# EAGLE design ingress_res (EAGLE 7.3.0)

## Sheet 1 of 2
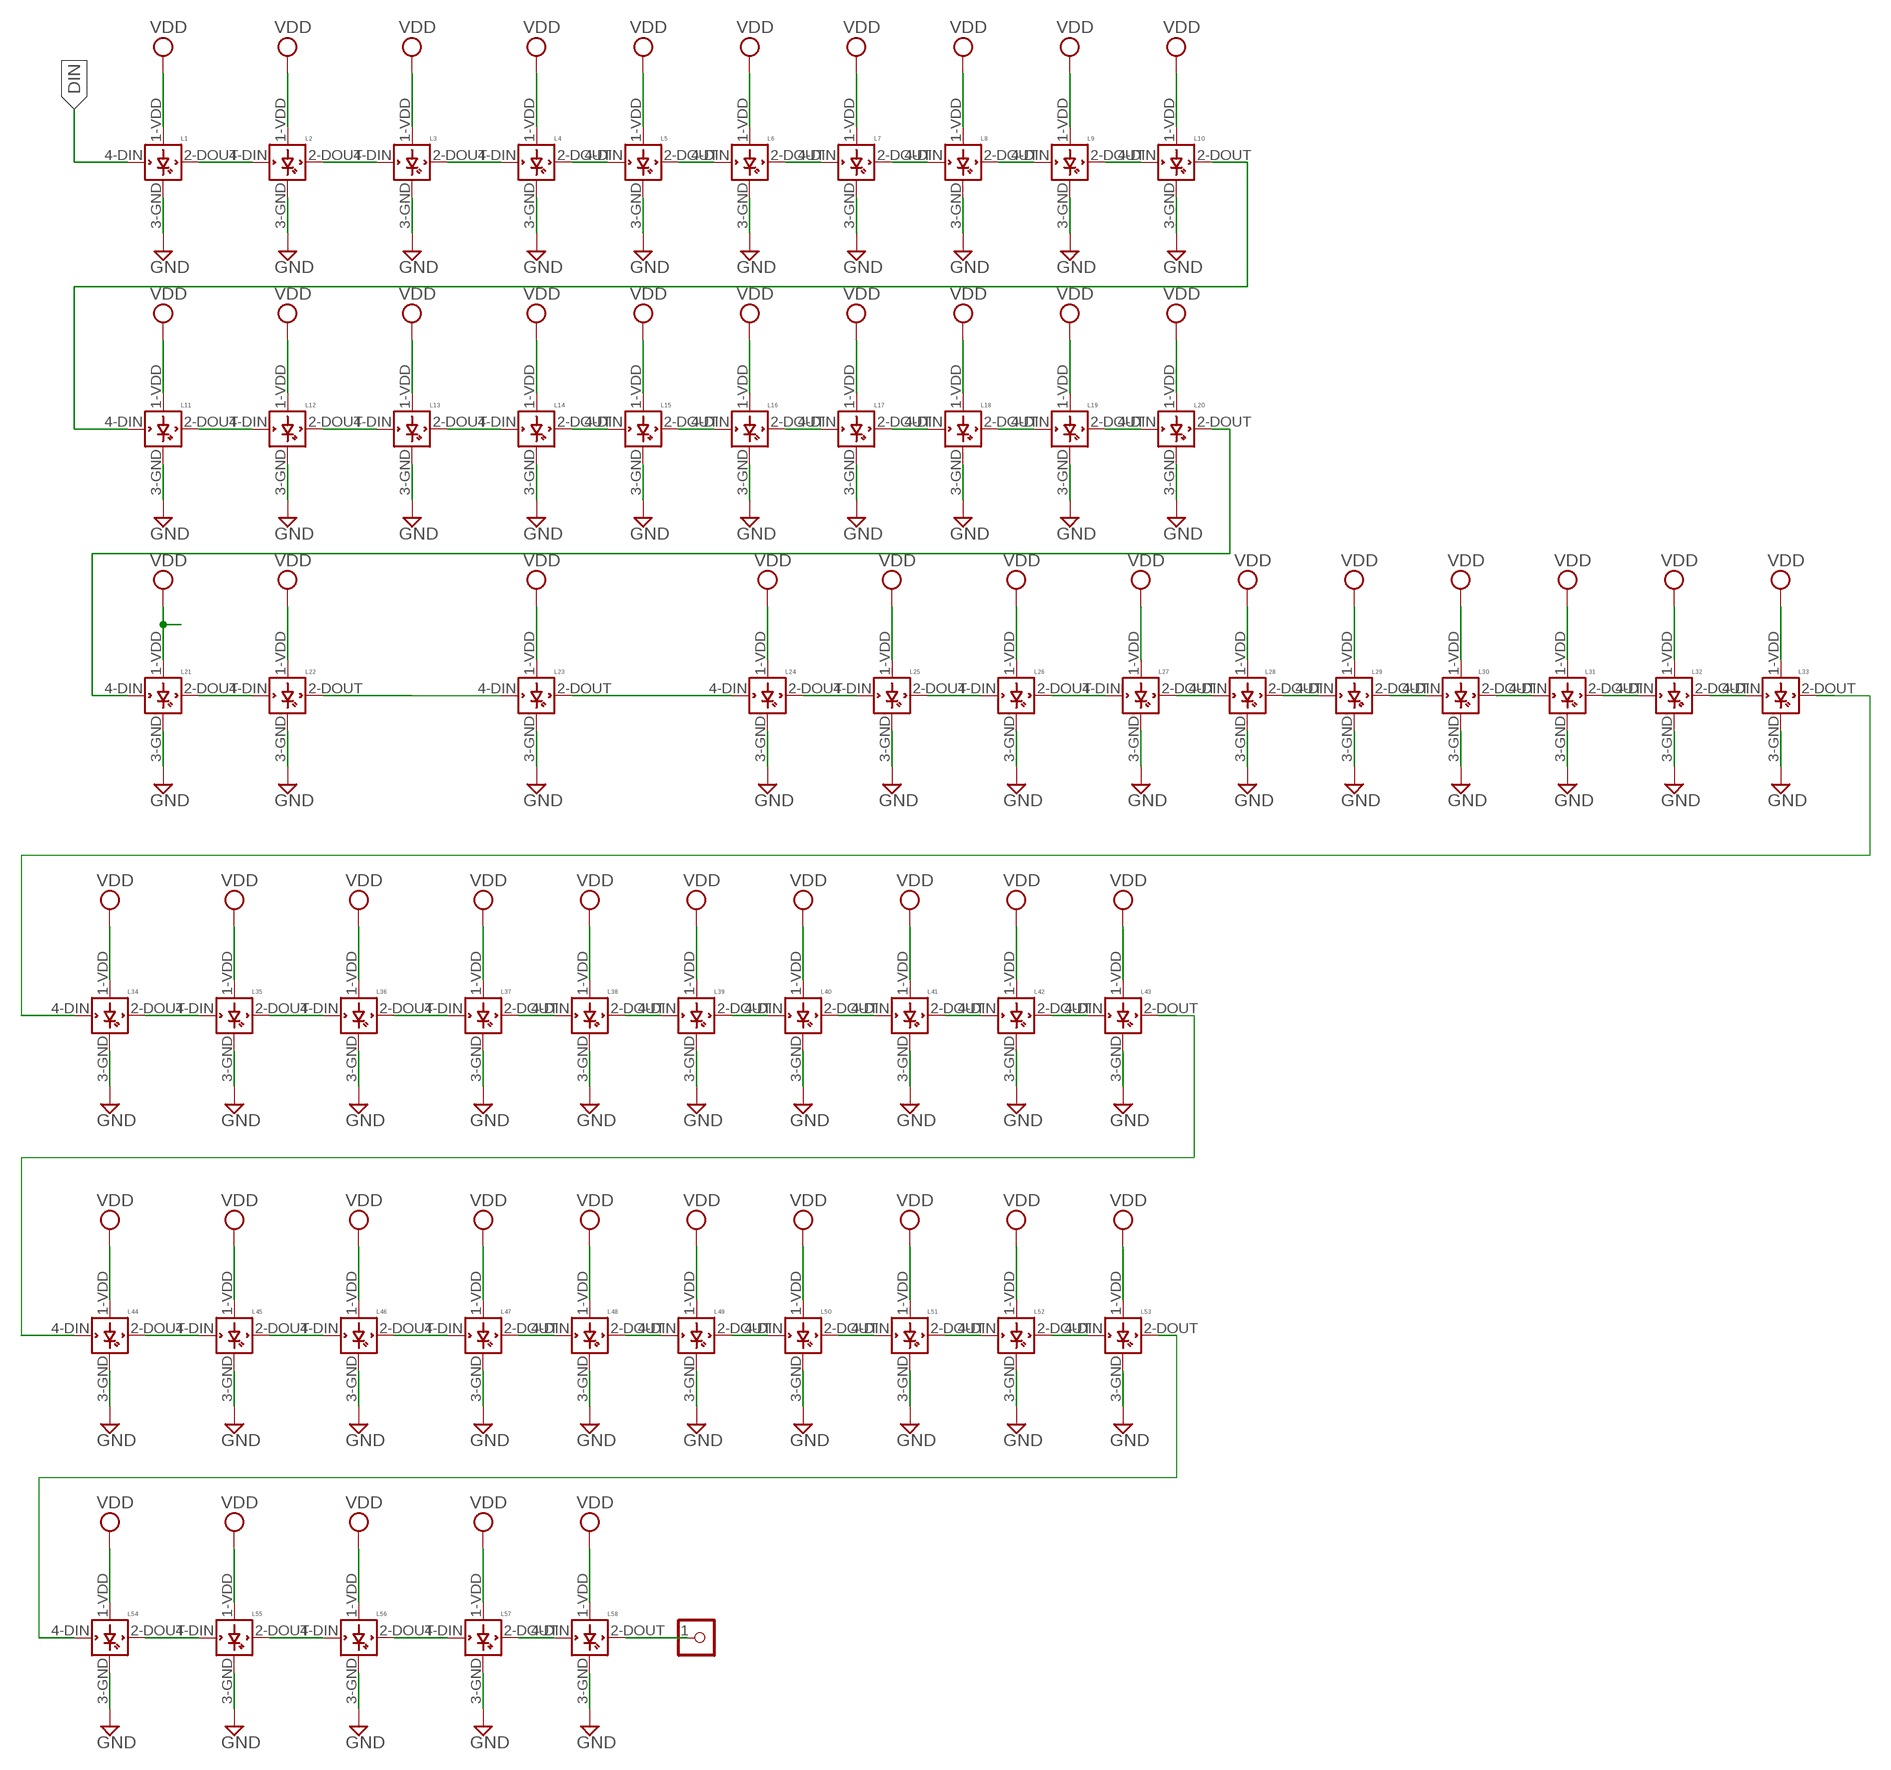
[diagram p0: schematic, sheet 1]

### Parts
J1  CON_HEADER_1X01-PTH_10_17  [M1X2_10_17]
L1  WS2812B  [WS2812B]
L2  WS2812B  [WS2812B]
L3  WS2812B  [WS2812B]
L4  WS2812B  [WS2812B]
L5  WS2812B  [WS2812B]
L6  WS2812B  [WS2812B]
L7  WS2812B  [WS2812B]
L8  WS2812B  [WS2812B]
L9  WS2812B  [WS2812B]
L10  WS2812B  [WS2812B]
L11  WS2812B  [WS2812B]
L12  WS2812B  [WS2812B]
L13  WS2812B  [WS2812B]
L14  WS2812B  [WS2812B]
L15  WS2812B  [WS2812B]
L16  WS2812B  [WS2812B]
L17  WS2812B  [WS2812B]
L18  WS2812B  [WS2812B]
L19  WS2812B  [WS2812B]
L20  WS2812B  [WS2812B]
L21  WS2812B  [WS2812B]
L22  WS2812B  [WS2812B]
L23  WS2812B  [WS2812B]
L24  WS2812B  [WS2812B]
L25  WS2812B  [WS2812B]
L26  WS2812B  [WS2812B]
L27  WS2812B  [WS2812B]
L28  WS2812B  [WS2812B]
L29  WS2812B  [WS2812B]
L30  WS2812B  [WS2812B]
L31  WS2812B  [WS2812B]
L32  WS2812B  [WS2812B]
L33  WS2812B  [WS2812B]
L34  WS2812B  [WS2812B]
L35  WS2812B  [WS2812B]
L36  WS2812B  [WS2812B]
L37  WS2812B  [WS2812B]
L38  WS2812B  [WS2812B]
L39  WS2812B  [WS2812B]
L40  WS2812B  [WS2812B]
L41  WS2812B  [WS2812B]
L42  WS2812B  [WS2812B]
L43  WS2812B  [WS2812B]
L44  WS2812B  [WS2812B]
L45  WS2812B  [WS2812B]
L46  WS2812B  [WS2812B]
L47  WS2812B  [WS2812B]
L48  WS2812B  [WS2812B]
L49  WS2812B  [WS2812B]
L50  WS2812B  [WS2812B]
L51  WS2812B  [WS2812B]
L52  WS2812B  [WS2812B]
L53  WS2812B  [WS2812B]
L54  WS2812B  [WS2812B]
L55  WS2812B  [WS2812B]
L56  WS2812B  [WS2812B]
L57  WS2812B  [WS2812B]
L58  WS2812B  [WS2812B]

### Nets
DIN: L1.4-DIN(DIN) ; also sheet 2
GND: L1.3-GND(GND) L2.3-GND(GND) L3.3-GND(GND) L4.3-GND(GND) L5.3-GND(GND) L6.3-GND(GND) L7.3-GND(GND) L8.3-GND(GND) L9.3-GND(GND) L10.3-GND(GND) L11.3-GND(GND) L12.3-GND(GND) L13.3-GND(GND) L14.3-GND(GND) L15.3-GND(GND) L16.3-GND(GND) L17.3-GND(GND) L18.3-GND(GND) L19.3-GND(GND) L20.3-GND(GND) L21.3-GND(GND) L22.3-GND(GND) L23.3-GND(GND) L24.3-GND(GND) L25.3-GND(GND) L26.3-GND(GND) L27.3-GND(GND) L28.3-GND(GND) L29.3-GND(GND) L30.3-GND(GND) L31.3-GND(GND) L32.3-GND(GND) L33.3-GND(GND) L34.3-GND(GND) L35.3-GND(GND) L36.3-GND(GND) L37.3-GND(GND) L38.3-GND(GND) L39.3-GND(GND) L40.3-GND(GND) L41.3-GND(GND) L42.3-GND(GND) L43.3-GND(GND) L44.3-GND(GND) L45.3-GND(GND) L46.3-GND(GND) L47.3-GND(GND) L48.3-GND(GND) L49.3-GND(GND) L50.3-GND(GND) L51.3-GND(GND) L52.3-GND(GND) L53.3-GND(GND) L54.3-GND(GND) L55.3-GND(GND) L56.3-GND(GND) L57.3-GND(GND) L58.3-GND(GND) ; also sheet 2
N$1: L1.2-DOUT(DOUT) L2.4-DIN(DIN)
N$2: L3.2-DOUT(DOUT) L4.4-DIN(DIN)
N$3: L4.2-DOUT(DOUT) L5.4-DIN(DIN)
N$4: L5.2-DOUT(DOUT) L6.4-DIN(DIN)
N$5: L6.2-DOUT(DOUT) L7.4-DIN(DIN)
N$6: L7.2-DOUT(DOUT) L8.4-DIN(DIN)
N$7: L8.2-DOUT(DOUT) L9.4-DIN(DIN)
N$8: L9.2-DOUT(DOUT) L10.4-DIN(DIN)
N$9: L11.2-DOUT(DOUT) L12.4-DIN(DIN)
N$10: L12.2-DOUT(DOUT) L13.4-DIN(DIN)
N$11: L13.2-DOUT(DOUT) L14.4-DIN(DIN)
N$12: L14.2-DOUT(DOUT) L15.4-DIN(DIN)
N$13: L15.2-DOUT(DOUT) L16.4-DIN(DIN)
N$14: L16.2-DOUT(DOUT) L17.4-DIN(DIN)
N$15: L17.2-DOUT(DOUT) L18.4-DIN(DIN)
N$16: L18.2-DOUT(DOUT) L19.4-DIN(DIN)
N$17: L19.2-DOUT(DOUT) L20.4-DIN(DIN)
N$18: L21.2-DOUT(DOUT) L22.4-DIN(DIN)
N$19: L22.2-DOUT(DOUT) L23.4-DIN(DIN)
N$25: L10.2-DOUT(DOUT) L11.4-DIN(DIN)
N$26: L20.2-DOUT(DOUT) L21.4-DIN(DIN)
N$27: L2.2-DOUT(DOUT) L3.4-DIN(DIN)
N$38: L23.2-DOUT(DOUT) L24.4-DIN(DIN)
N$39: L24.2-DOUT(DOUT) L25.4-DIN(DIN)
N$40: L25.2-DOUT(DOUT) L26.4-DIN(DIN)
N$41: L26.2-DOUT(DOUT) L27.4-DIN(DIN)
N$42: L27.2-DOUT(DOUT) L28.4-DIN(DIN)
N$43: L28.2-DOUT(DOUT) L29.4-DIN(DIN)
N$44: L29.2-DOUT(DOUT) L30.4-DIN(DIN)
N$45: L30.2-DOUT(DOUT) L31.4-DIN(DIN)
N$46: L31.2-DOUT(DOUT) L32.4-DIN(DIN)
N$47: L32.2-DOUT(DOUT) L33.4-DIN(DIN)
N$49: L33.2-DOUT(DOUT) L34.4-DIN(DIN)
N$50: L34.2-DOUT(DOUT) L35.4-DIN(DIN)
N$51: L35.2-DOUT(DOUT) L36.4-DIN(DIN)
N$52: L36.2-DOUT(DOUT) L37.4-DIN(DIN)
N$53: L37.2-DOUT(DOUT) L38.4-DIN(DIN)
N$54: L38.2-DOUT(DOUT) L39.4-DIN(DIN)
N$55: L39.2-DOUT(DOUT) L40.4-DIN(DIN)
N$56: L40.2-DOUT(DOUT) L41.4-DIN(DIN)
N$57: L41.2-DOUT(DOUT) L42.4-DIN(DIN)
N$58: L42.2-DOUT(DOUT) L43.4-DIN(DIN)
N$60: L43.2-DOUT(DOUT) L44.4-DIN(DIN)
N$61: L44.2-DOUT(DOUT) L45.4-DIN(DIN)
N$62: L45.2-DOUT(DOUT) L46.4-DIN(DIN)
N$63: L46.2-DOUT(DOUT) L47.4-DIN(DIN)
N$64: L47.2-DOUT(DOUT) L48.4-DIN(DIN)
N$65: L48.2-DOUT(DOUT) L49.4-DIN(DIN)
N$66: L49.2-DOUT(DOUT) L50.4-DIN(DIN)
N$67: L50.2-DOUT(DOUT) L51.4-DIN(DIN)
N$68: L51.2-DOUT(DOUT) L52.4-DIN(DIN)
N$69: L52.2-DOUT(DOUT) L53.4-DIN(DIN)
N$70: L53.2-DOUT(DOUT) L54.4-DIN(DIN)
N$72: L54.2-DOUT(DOUT) L55.4-DIN(DIN)
N$73: L55.2-DOUT(DOUT) L56.4-DIN(DIN)
N$74: L56.2-DOUT(DOUT) L57.4-DIN(DIN)
N$75: L57.2-DOUT(DOUT) L58.4-DIN(DIN)
N$76: J1.1 L58.2-DOUT(DOUT)
VCC: L1.1-VDD(VDD) L2.1-VDD(VDD) L3.1-VDD(VDD) L4.1-VDD(VDD) L5.1-VDD(VDD) L6.1-VDD(VDD) L7.1-VDD(VDD) L8.1-VDD(VDD) L9.1-VDD(VDD) L10.1-VDD(VDD) L11.1-VDD(VDD) L12.1-VDD(VDD) L13.1-VDD(VDD) L14.1-VDD(VDD) L15.1-VDD(VDD) L16.1-VDD(VDD) L17.1-VDD(VDD) L18.1-VDD(VDD) L19.1-VDD(VDD) L20.1-VDD(VDD) L21.1-VDD(VDD) L22.1-VDD(VDD) L23.1-VDD(VDD) L24.1-VDD(VDD) L25.1-VDD(VDD) L26.1-VDD(VDD) L27.1-VDD(VDD) L28.1-VDD(VDD) L29.1-VDD(VDD) L30.1-VDD(VDD) L31.1-VDD(VDD) L32.1-VDD(VDD) L33.1-VDD(VDD) L34.1-VDD(VDD) L35.1-VDD(VDD) L36.1-VDD(VDD) L37.1-VDD(VDD) L38.1-VDD(VDD) L39.1-VDD(VDD) L40.1-VDD(VDD) L41.1-VDD(VDD) L42.1-VDD(VDD) L43.1-VDD(VDD) L44.1-VDD(VDD) L45.1-VDD(VDD) L46.1-VDD(VDD) L47.1-VDD(VDD) L48.1-VDD(VDD) L49.1-VDD(VDD) L50.1-VDD(VDD) L51.1-VDD(VDD) L52.1-VDD(VDD) L53.1-VDD(VDD) L54.1-VDD(VDD) L55.1-VDD(VDD) L56.1-VDD(VDD) L57.1-VDD(VDD) L58.1-VDD(VDD) ; supply symbol labelled VDD ; also sheet 2

## Sheet 2 of 2
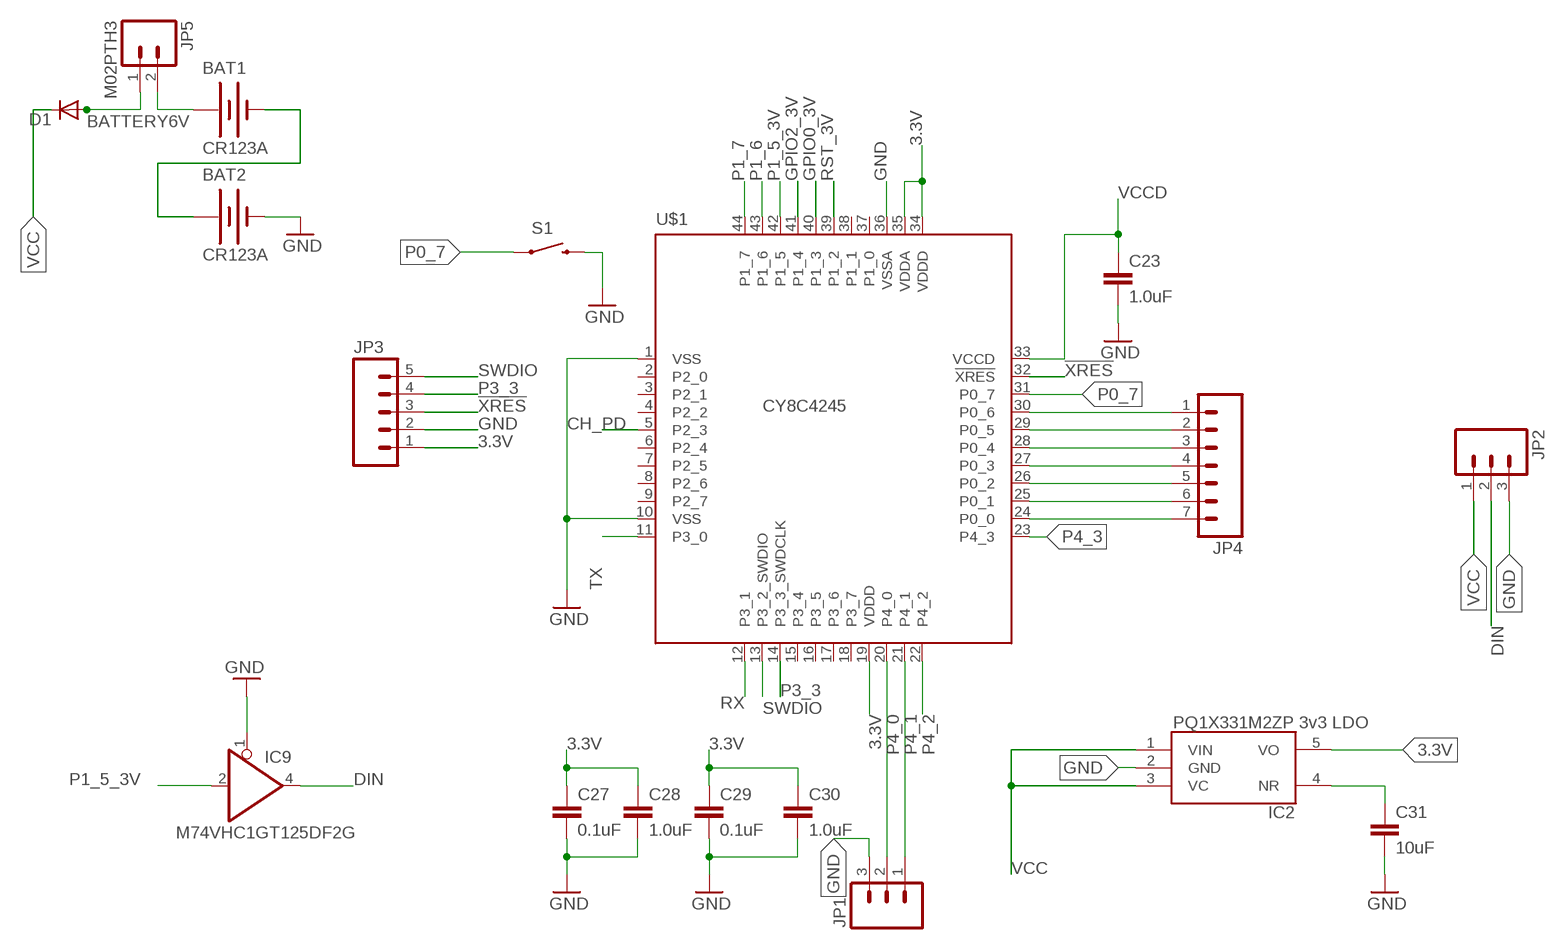
[diagram p1: schematic, sheet 2]

### Parts
BAT1  CR123A  BATTERYCR123A  [BATTERY_CR123A]
BAT2  CR123A  BATTERYCR123A  [BATTERY_CR123A]
C23  1.0uF  CAP0805  [0805]
C27  0.1uF  CAP0805  [0805]
C28  1.0uF  CAP0805  [0805]
C29  0.1uF  CAP0805  [0805]
C30  1.0uF  CAP0805  [0805]
C31  10uF  CAP0805  [0805]
D1  DIODESMA  [SMA-DIODE]
IC2  PQ1X331M2ZP-3V3-LDO-SOT-23-5  [SOT-23-5]
IC9  M74VHC1GT125DF2G  74AHC1G125DCK  [SC70-5]
JP1  M031X03_NO_SILK  [1X03_NO_SILK]
JP2  M031X03_NO_SILK  [1X03_NO_SILK]
JP3  M05PTH  [1X05]
JP4  M07  [1X07]
JP5  M02PTH3  [1X02_LONGPADS]
S1  SPARKFUN_SWITCH-MOMENTARY-2SMD  [SPARKFUN_TACTILE_SWITCH_SMD]
U$1  CY8C4245  CY8C4245AXI-483  [TQFP44]

### Nets
3.3V: C27.1 C28.1 C29.1 C30.1 IC2.5(VO) JP3.1 U$1.19(VDDD) U$1.34(VDDD) U$1.35(VDDA)
!XRES: JP3.3 U$1.32(!XRES)
BATTERY6V: D1.A JP5.1
CH_PD: U$1.5(P2_3)
DIN: IC9.4(O) JP2.2 ; also sheet 1
GND: BAT2.- C23.2 C27.2 C28.2 C29.2 C30.2 C31.2 IC2.2(GND) IC9.1(OE) JP1.3 JP2.3 JP3.2 S1.3 U$1.1(VSS) U$1.10(VSS) U$1.36(VSSA) ; also sheet 1
GPIO0_3V: U$1.40(P1_3)
GPIO2_3V: U$1.41(P1_4)
N$24: C31.1 IC2.4(NR)
N$28: BAT1.- BAT2.+
N$29: JP4.7 U$1.24(P0_0)
N$30: JP4.6 U$1.25(P0_1)
N$31: JP4.5 U$1.26(P0_2)
N$32: JP4.4 U$1.27(P0_3)
N$33: JP4.3 U$1.28(P0_4)
N$34: JP4.2 U$1.29(P0_5)
N$35: JP4.1 U$1.30(P0_6)
N$36: BAT1.+ JP5.2
P0_7: S1.1 U$1.31(P0_7)
P1_5_3V: IC9.2(I) U$1.42(P1_5)
P1_6: U$1.43(P1_6)
P1_7: U$1.44(P1_7)
P3_3: JP3.4 U$1.14(P3_3_SWDCLK)
P4_0: JP1.2 U$1.20(P4_0)
P4_1: JP1.1 U$1.21(P4_1)
P4_2: U$1.22(P4_2)
P4_3: U$1.23(P4_3)
RST_3V: U$1.39(P1_2)
RX: U$1.12(P3_1)
SWDIO: JP3.5 U$1.13(P3_2_SWDIO)
TX: U$1.11(P3_0)
VCC: D1.C IC2.1(VIN) IC2.3(VC) JP2.1 ; also sheet 1
VCCD: C23.1 U$1.33(VCCD)
Unconnected: U$1.2(P2_0) U$1.3(P2_1) U$1.4(P2_2) U$1.6(P2_4) U$1.7(P2_5) U$1.8(P2_6) U$1.9(P2_7) U$1.15(P3_4) U$1.16(P3_5) U$1.17(P3_6) U$1.18(P3_7) U$1.37(P1_0) U$1.38(P1_1)

## Power pins joined to a net without a drawn wire
GND: IC9.3(GND)
VCC: IC9.5(VCC)

## Library data of the parts
BAT1 BAT2 = ingress_res:BATTERY: Battery Holders Various common sizes : AA, AAA, 20mm coin cell and 12mm coin cell.
C23 C27-C31 = SparkFun-Capacitors:CAP: Capacitor Standard 0603 ceramic capacitor, and 0.1" leaded capacitor.
D1 = SparkFun-DiscreteSemi:DIODE: Diode These are standard reverse protection diodes and small signal diodes. SMA package can handle up to about 1A. SOD-323 can handle about 200mA. What the SOD-323 package when ordering, there are some mfgs out there that are 5-pin packages.
IC2 = STM32-PROX:PQ1X331M2ZP-3V3-LDO-SOT-23-5
IC9 = 74xx-little-de:74*1G125: Single Bus Buffer Gate with 3-State Output; DIGIKEY-ND: M74VHC1GT125DF1GOSCT-ND; MOUSER: 863-M74VHC1GT125DF2G; PARTNO: M74VHC1GT125DF2G
J1 = dp_devices:CON_HEADER_1X01
JP1 JP2 = SparkFun-Connectors:M03: Header 3 Standard 3-pin 0.1" header. Use with straight break away headers (SKU : PRT-00116), right angle break away headers (PRT-00553), swiss pins (PRT-00743), machine pins (PRT-00117), and female headers (PRT-00115). Molex polarized connector foot print use with SKU : PRT-08232 with associated crimp pins and housings.
JP3 = SparkFun-Connectors:M05: Header 5 Standard 5-pin 0.1" header. Use with straight break away headers (SKU : PRT-00116), right angle break away headers (PRT-00553), swiss pins (PRT-00743), machine pins (PRT-00117), and female headers (PRT-00115). Molex polarized connector foot print use with SKU : PRT-08230 with associated crimp pins and housings.
JP4 = SparkFun:M07: Header 7 Standard 7-pin 0.1" header. Use with straight break away headers (SKU : PRT-00116), right angle break away headers (PRT-00553), swiss pins (PRT-00743), machine pins (PRT-00117), and female headers (PRT-00115). NOTES ON THE VARIANTS LOCK and LOCK_LONGPADS... This footprint was designed to help hold the alignment of a through-hole component (i.e. 7-pin header) while soldering it into place. You may notice that each hole has been shifted either up or down by 0.005 of an inch from it's more standard position (which is usually a perfectly straight line). This slight alteration caused the pins (the squares in the middle) to touch the edges of the holes. Because they are alternating, it causes a "brace" to hold the header in place. 0.005 has proven to be the perfect amount of "off-center" position when using our standard breakaway headers. Although looks a little odd when you look at the bare footprint, once you have a header in there, the alteration is very hard to notice. Also, if you push a header all the way into place, it is covered up entirely on the bottom side. This idea of altering the position of holes to aid alignment will be further integrated into the Sparkfun Library for other footprints. It can help hold any component with 3 or more connection pins.
JP5 = SparkFun-Connectors:M02: Standard 2-pin 0.1" header. Use with - straight break away headers ( PRT-00116) - right angle break away headers (PRT-00553) - swiss pins (PRT-00743) - machine pins (PRT-00117) - female headers (PRT-00115) Molex polarized connector foot print use with: PRT-08233 with associated crimp pins and housings. 2.54_SCREWTERM for use with PRT-10571. 3.5mm Screw Terminal footprints for PRT-08084 5mm Screw Terminal footprints for use with PRT-08433
L1-L58 = adafruit:WS2812B
S1 = Nullspace:SPARKFUN_SWITCH-MOMENTARY-2
U$1 = cypress:CY8C4245AXI-483

## Net classes
0 default: width 0.203 mm

## Board
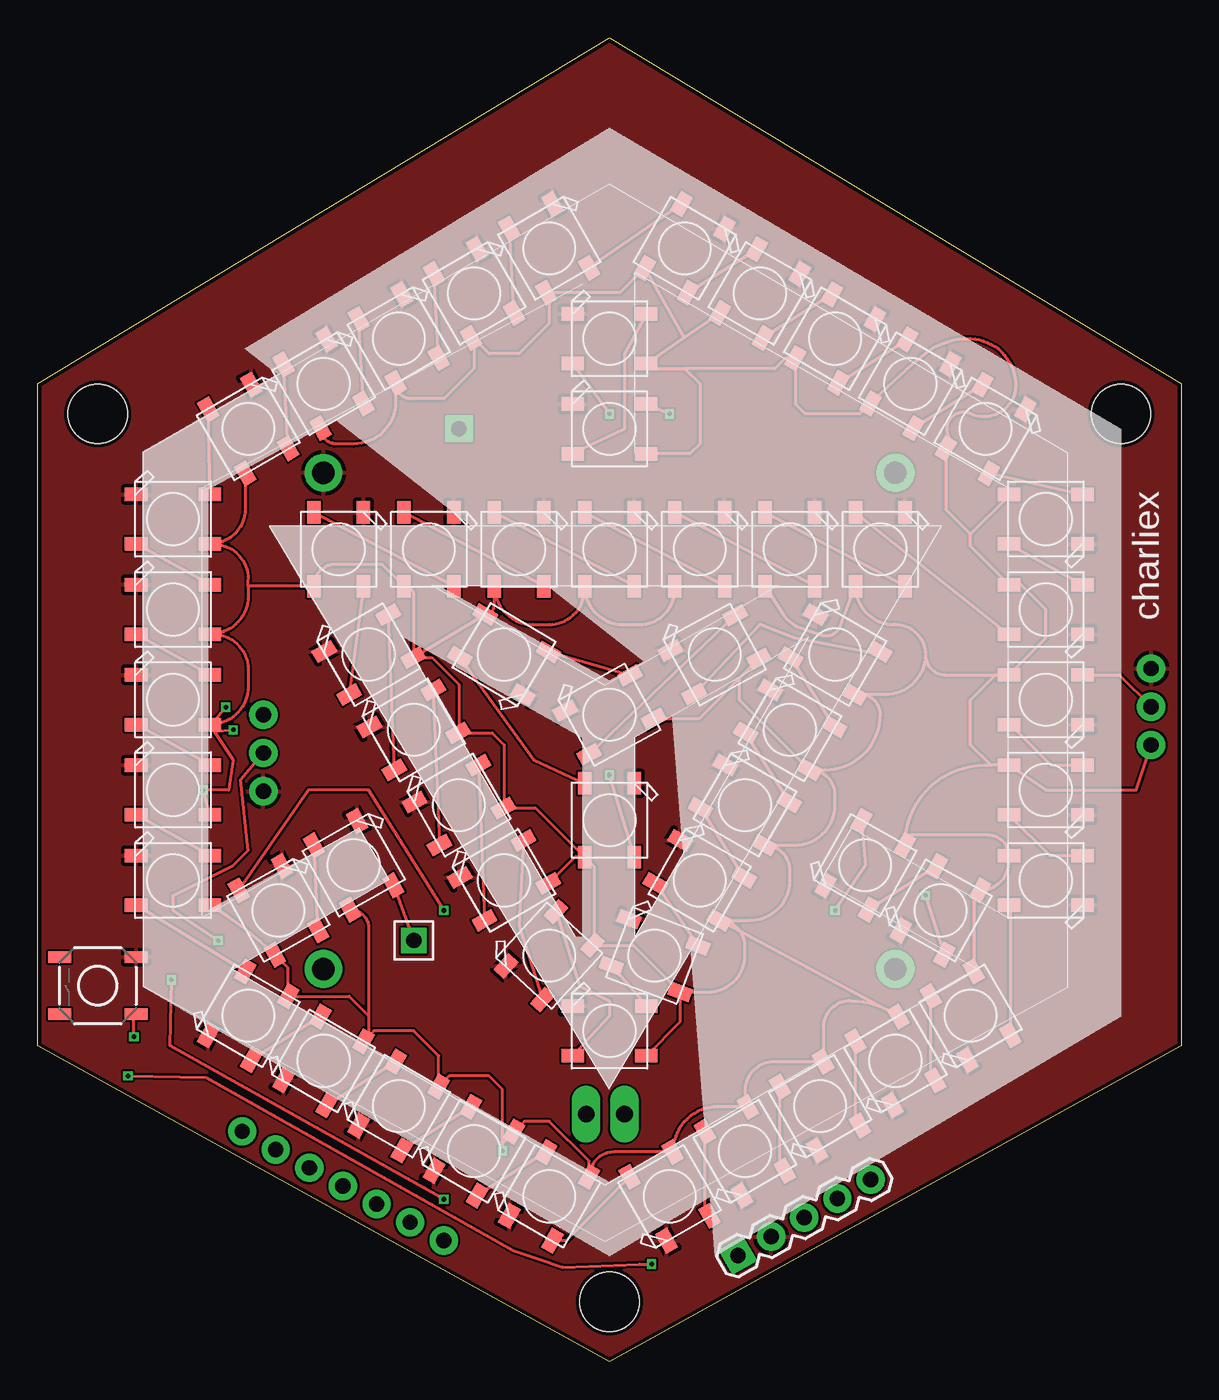
[diagram p2: board, top side]
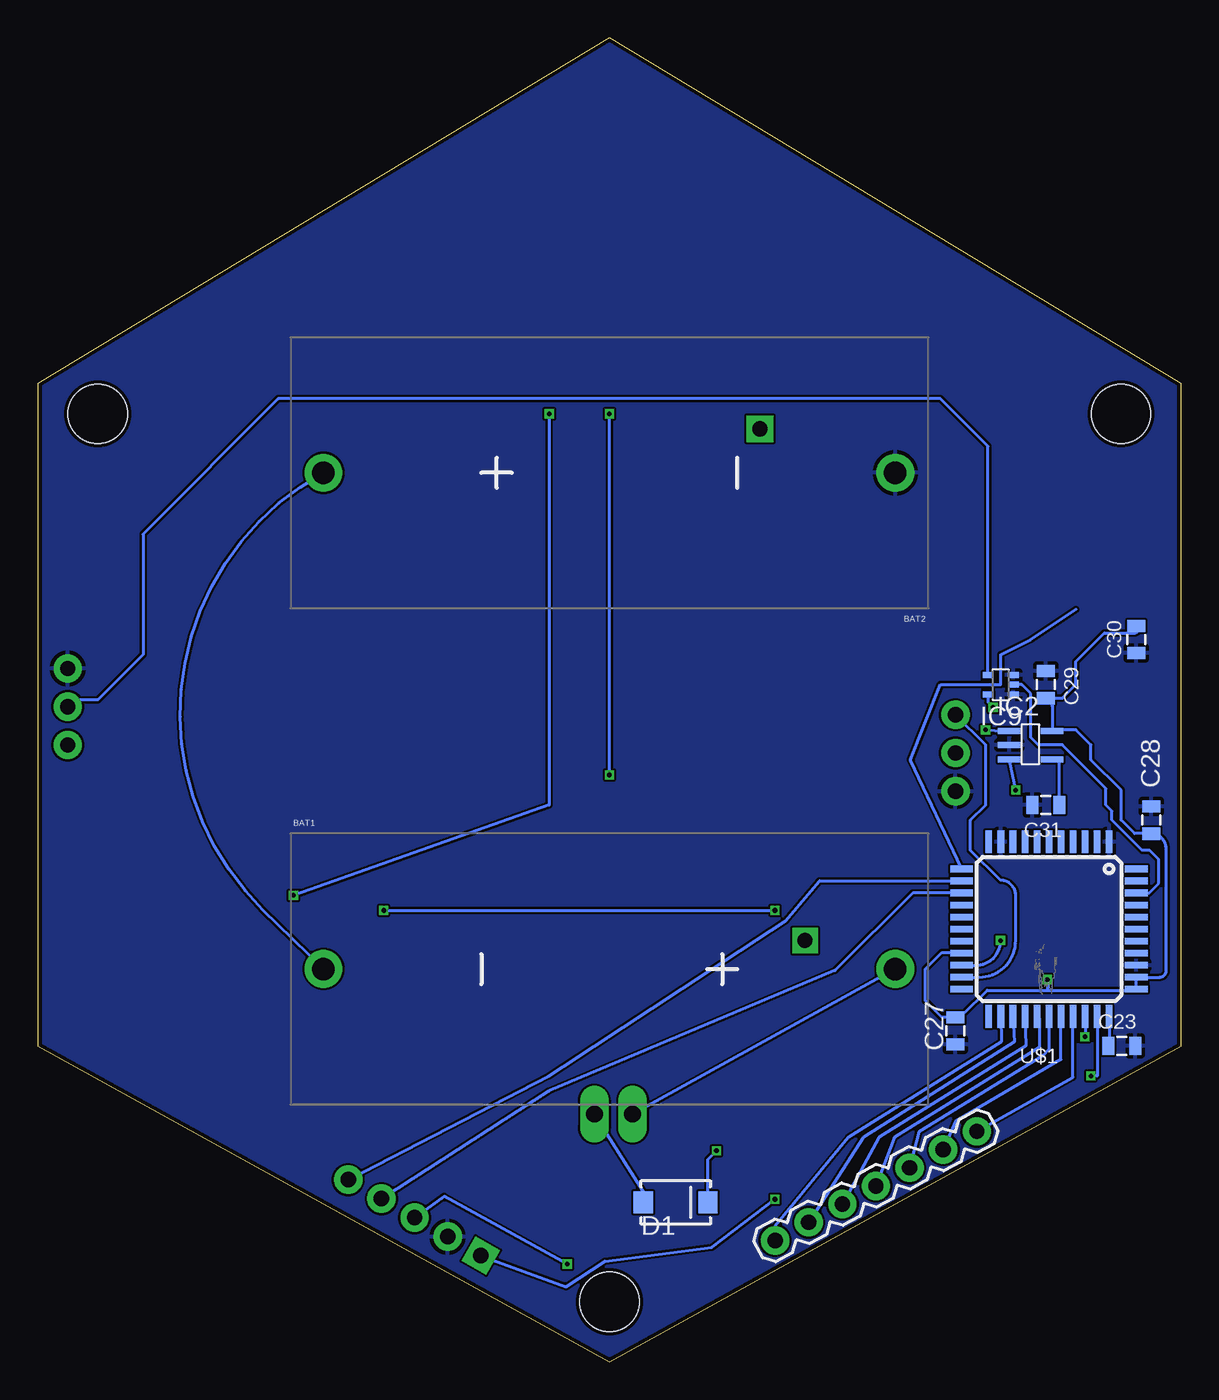
[diagram p3: board, bottom side, seen from below]

Size 76 x 88 mm. Coordinates in mm from the lower left corner, seen from the top.
Outline: 38,0 0,21 0,65 38,88 76,65 76,21 38,0
Copper layers (1*16): Top 0.035mm / dielectric 1.5mm / Bottom 0.035mm
Design rules "ITEADstudio_DRC": minimum track width 6mil, minimum drill 12mil, track to track 6mil, track to pad 6mil, pad to pad 6mil, via to via 6mil, smd to smd 0mil, copper to edge 10mil, drill to drill 10mil, minimum pad ring 10mil, minimum via ring 6mil, stop-mask expansion 2mil, vias tented up to drill 100mil, thermal gap 10mil
Holes 3.94 mm at 72,63 4,63 38,4

### Footprints (pad centres in the part's own frame; a part is rotated, then mirrored left to right if it is on the bottom)
BATTERY_CR123A = drill 1.5 pad 2.5: + 19,0; - -19,0
0805 = smd 0.8 x 1.2: 1 -0.9,0; 2 0.9,0
SMA-DIODE = smd 1.27 x 1.47: A -2.15,0; C 2.15,0
SOT-23-5 = smd 0.4 x 1.5: 1 -0.94,-1.422; 2 0.01,-1.422; 3 0.96,-1.422; 4 0.96,1.428; 5 -0.94,1.428
SC70-5 = smd 0.4 x 0.7: 1 -0.65,-0.85; 2 0,-0.85; 3 0.65,-0.85; 4 0.65,0.85; 5 -0.65,0.85
M1X2_10_17 = drill 1 pad 1.7 square: 1 0,0
1X03_NO_SILK = drill 1.016 pad 1.88: 1 0,0; 2 2.54,0; 3 5.08,0
1X05 = drill 1.016 pad 1.88 square: 1 0,0 | drill 1.016 pad 1.88: 2 2.54,0; 3 5.08,0; 4 7.62,0; 5 10.16,0
1X07 = drill 1.016 pad 1.88: 1 0,0; 2 2.54,0; 3 5.08,0; 4 7.62,0; 5 10.16,0; 6 12.7,0; 7 15.24,0
1X02_LONGPADS = drill 1.118 pad 1.88 long: 1 0,0; 2 2.54,0
WS2812B = smd 1.5 x 0.9: 1-VDD 2.45,-1.65; 2-DOUT 2.45,1.65; 3-GND -2.45,1.65; 4-DIN -2.45,-1.65
SPARKFUN_TACTILE_SWITCH_SMD = smd 1.524 x 0.762: 1 -2.54,1.905; 2 2.54,1.905; 3 -2.54,-1.905; 4 2.54,-1.905
TQFP44 = smd 1.5 x 0.44: 1 -5.8,4; 2 -5.8,3.2; 3 -5.8,2.4; 4 -5.8,1.6; 5 -5.8,0.8; 6 -5.8,0; 7 -5.8,-0.8; 8 -5.8,-1.6; 9 -5.8,-2.4; 10 -5.8,-3.2; 11 -5.8,-4; 23 5.8,-4; 24 5.8,-3.2; 25 5.8,-2.4; 26 5.8,-1.6; 27 5.8,-0.8; 28 5.8,0; 29 5.8,0.8; 30 5.8,1.6; 31 5.8,2.4; 32 5.8,3.2; 33 5.8,4 | smd 0.44 x 1.5: 12 -4,-5.8; 13 -3.2,-5.8; 14 -2.4,-5.8; 15 -1.6,-5.8; 16 -0.8,-5.8; 17 0,-5.8; 18 0.8,-5.8; 19 1.6,-5.8; 20 2.4,-5.8; 21 3.2,-5.8; 22 4,-5.8; 34 4,5.8; 35 3.2,5.8; 36 2.4,5.8; 37 1.6,5.8; 38 0.8,5.8; 39 0,5.8; 40 -0.8,5.8; 41 -1.6,5.8; 42 -2.4,5.8; 43 -3.2,5.8; 44 -4,5.8

### Placement (x,y rotation side)
BAT1  38,26.11 0 bottom
BAT2  38,59.08 180 bottom
C23  3.96,21.01 0 bottom
C27  15,22 270 bottom
C28  2,36 90 bottom
C29  9,45 90 bottom
C30  3,48 270 bottom
C31  9,37 180 bottom
D1  33.6,10.6 0 bottom
IC2  10,41 270 bottom
IC9  12,45 90 bottom
J1  25,28 0 top
JP1  15,43 270 top
JP2  74,41 90 bottom
JP3  46.54,7.06 29.8 top
JP4  13.59,15.32 208.4 bottom
JP5  39,16.46 180 top
L1  67,44 180 top
L2  67,38 180 top
L3  67,32 180 top
L4  62,23 120 top
L5  57,20 120 top
L6  52,17 120 top
L7  47,14 120 top
L8  42,11 120 top
L9  34,11 60 top
L10  29,14 60 top
L11  24,17 60 top
L12  19,20 60 top
L13  14,23 60 top
L14  9,32 0 top
L15  9,38 0 top
L16  9,44 0 top
L17  9,50 0 top
L18  9,56 0 top
L19  14,62 300 top
L20  19,65 300 top
L21  24,68 300 top
L22  29,71 300 top
L23  34,74 300 top
L24  43,74 240 top
L25  48,71 240 top
L26  53,68 240 top
L27  58,65 240 top
L28  63,62 240 top
L29  67,56 180 top
L30  67,50 180 top
L31  56,54 270 top
L32  50,54 270 top
L33  44,54 270 top
L34  38,54 270 top
L35  32,54 270 top
L36  26,54 270 top
L37  20,54 270 top
L38  22,47 30 top
L39  25,42 30 top
L40  28,37 30 top
L41  31,32 30 top
L42  34,27 47.4 top
L43  38,22 0 top
L44  41,27 339.1 top
L45  44,32 330 top
L46  47,37 330 top
L47  50,42 330 top
L48  53,47 330 top
L49  45,47 28.6 top
L50  38,43 28.6 top
L51  31,47 149.2 top
L52  38,36 270 top
L53  38,68 0 top
L54  38,62 0 top
L55  60,30 60.9 top
L56  55,33 60.9 top
L57  16,30 299.4 top
L58  21,33 299.4 top
S1  4,25 180 top
U$1  8.79,28.76 270 bottom

### Tracks (layer width: path | path; a pad name or v marks a point on that pad's centre or on a via)
3.3V  (via drill 0.3)
  Top 0.203: v27,10.8 8.8,21 v8.9,25.4
  Bottom 0.203: C27.1 14.52,22.9 | 14.52,22.9 15.9,22.9 17,24 17,26.1 15.9,27.2 14.63,27.2 U$1.19 | 14.52,22.9 14.52,23.08 12.9,24.7 8.9,24.7 | 8.9,24.7 3.05,24.7 U$1.34 U$1.35 1.44,25.56 arc-90 1,26 1,34.1 arc-90 C28.1 3.1,35.1 4,36 4,38 6,40 6,41 7,42 8.51,42 IC2.5 8.57,43.57 arc-90 9,44 C29.1 7.9,44.1 7,45 7,46.55 5.11,48.45 3.09,48.45 arc-156 C30.1 | JP3.1 40.9,5 38.3,6.7 31.2,7.6 v27,10.8 | v8.9,25.4 8.9,24.7
!XRES  (via drill 0.3)
  Top 0.203: v6,19 11.2,18.9 31.6,7.4 34.9,6.3 40,6.5 v40.8,6.5
  Bottom 0.203: U$1.32 5.59,19 v6,19 | v40.8,6.5 49,11 JP3.3
BATTERY6V
  Bottom 0.203: D1.A 35.75,11.29 JP5.1
DIN
  Top 0.203: L1.4-DIN 71.89,45.65 JP2.2
  Bottom 0.203: IC9.4 12.85,60.85 16,64 60,64 69,55 69,47 72,44 73.54,44 JP2.2
GND
  pour Top: 76,65 38,88 0,65 0,21 38,0 76,21
  pour Bottom: 76,65 38,88 0,65 0,21 38,0 76,21
N$1
  Top 0.203: L1.2-DOUT 64.65,42.35 67,40 67.35,39.65 L2.4-DIN
N$2
  Top 0.203: L3.2-DOUT 64.65,30.25 L4.4-DIN
N$3
  Top 0.203: L5.4-DIN 59.35,19.01 L4.2-DOUT
N$4
  Top 0.203: L6.4-DIN 54.35,16.01 L5.2-DOUT
N$5
  Top 0.203: L7.4-DIN 49.35,13.01 L6.2-DOUT
N$6
  Top 0.203: L8.4-DIN 44.35,10.01 L7.2-DOUT
N$7
  Top 0.203: L8.2-DOUT 35.1,8.05 L9.4-DIN
N$8
  Top 0.203: L9.2-DOUT L10.4-DIN
N$9
  Top 0.203: L11.2-DOUT L12.4-DIN
N$10
  Top 0.203: L12.2-DOUT L13.4-DIN
N$11
  Top 0.203: L13.2-DOUT L14.4-DIN
N$12
  Top 0.203: L14.2-DOUT L15.4-DIN
N$13
  Top 0.203: L15.2-DOUT L16.4-DIN
N$14
  Top 0.203: L16.2-DOUT L17.4-DIN
N$15
  Top 0.203: L17.2-DOUT L18.4-DIN
N$16
  Top 0.203: L18.2-DOUT L19.4-DIN
N$17
  Top 0.203: L19.2-DOUT L20.4-DIN
N$18
  Top 0.203: L21.2-DOUT L22.4-DIN
N$19
  Top 0.203: L22.2-DOUT L23.4-DIN
N$24
  Bottom 0.203: C31.1 8.1,40.04 IC2.4
N$25
  Top 0.203: L10.2-DOUT L11.4-DIN
N$26
  Top 0.203: L20.2-DOUT L21.4-DIN
N$27
  Top 0.203: L2.2-DOUT 67.25,33.65 L3.4-DIN
N$28
  Bottom 0.203: BAT1.- 61,30 arc107 BAT2.+
N$29
  Bottom 0.203: U$1.24 11.96,21.27 22.12,14.92 27,9 JP4.7
N$30
  Bottom 0.203: U$1.25 11.08,21.27 21.11,14.92 JP4.6
N$31
  Bottom 0.203: U$1.26 10.31,21.01 20.09,14.92 JP4.5
N$32
  Bottom 0.203: U$1.27 9.43,22.8 9.43,20.89 19.08,14.92 JP4.4
N$33
  Bottom 0.203: U$1.28 8.79,20.76 9.17,20.38 17.43,15.3 JP4.3
N$34
  Bottom 0.203: U$1.29 8,20.09 15,16 JP4.2
N$35
  Bottom 0.203: JP4.1 7.19,18.92 U$1.30
N$36
  Bottom 0.203: BAT1.+ JP5.2
N$37  (via drill 1.02 pad 1.78)
  other vias: 28,62
N$38
  Top 0.203: L23.2-DOUT L24.4-DIN
N$39
  Top 0.203: L24.2-DOUT L25.4-DIN
N$40
  Top 0.203: L25.2-DOUT L26.4-DIN
N$41
  Top 0.203: L26.2-DOUT L27.4-DIN
N$42
  Top 0.203: L27.2-DOUT L28.4-DIN
N$43
  Top 0.203: L28.2-DOUT L29.4-DIN
N$44
  Top 0.203: L29.2-DOUT L30.4-DIN
N$45
  Top 0.203: L30.2-DOUT L31.4-DIN
N$46
  Top 0.203: L31.2-DOUT L32.4-DIN
N$47
  Top 0.203: L32.2-DOUT L33.4-DIN
N$49
  Top 0.203: L33.2-DOUT L34.4-DIN
N$50
  Top 0.203: L34.2-DOUT L35.4-DIN
N$51
  Top 0.203: L35.2-DOUT L36.4-DIN
N$52
  Top 0.203: L36.2-DOUT L37.4-DIN
N$53
  Top 0.203: L37.2-DOUT L38.4-DIN
N$54
  Top 0.203: L38.2-DOUT L39.4-DIN
N$55
  Top 0.203: L39.2-DOUT L40.4-DIN
N$56
  Top 0.203: L40.2-DOUT L41.4-DIN
N$57
  Top 0.203: L41.2-DOUT 32,29 L42.4-DIN
N$58
  Top 0.203: L42.2-DOUT 36,25 38,24 38,23 L43.4-DIN
N$60
  Top 0.203: L43.2-DOUT L44.4-DIN
N$61
  Top 0.203: L44.2-DOUT L45.4-DIN
N$62
  Top 0.203: L46.4-DIN L45.2-DOUT
N$63
  Top 0.203: L46.2-DOUT L47.4-DIN
N$64
  Top 0.203: L47.2-DOUT L48.4-DIN
N$65
  Top 0.203: L48.2-DOUT 56,47 50.3,48.1 48,49 L49.4-DIN
N$66
  Top 0.203: L49.2-DOUT L50.4-DIN
N$67
  Top 0.203: L50.2-DOUT L51.4-DIN
N$68
  Top 0.203: L51.2-DOUT 33,40 L52.4-DIN
N$69  (via drill 0.3)
  Top 0.203: L52.2-DOUT v38,39 | v38,63 L53.4-DIN
  Bottom 0.203: v38,39 v38,63
N$70
  Top 0.203: L53.2-DOUT 39,67 39,62 L54.4-DIN
N$72  (via drill 0.3)
  Top 0.203: L54.2-DOUT v42,63 | v59,31 L55.4-DIN
  Bottom 0.203: v42,63 42,37 v59,31
N$73
  Top 0.203: L55.2-DOUT L56.4-DIN
N$74  (via drill 0.3)
  Top 0.203: L56.2-DOUT 55,33 v53,30 | v27,30 22,38 18,38 L57.4-DIN
  Bottom 0.203: v53,30 37,30 v27,30
N$75
  Top 0.203: L57.2-DOUT L58.4-DIN
N$76
  Top 0.203: L58.2-DOUT J1.1
P0_7  (via drill 0.3)
  Top 0.203: v6.4,21.6 U$1.31 arc-90 S1.1
  Bottom 0.203: U$1.31 v6.39,21.61 arc90 v6.4,21.6
P1_5_3V
  Bottom 0.203: U$1.42 2.14,31.16 1.5,31.8 1.5,33.4 2.1,34 2.6,34 4.6,36 4.6,36.6 5,37 5,38.1 7.9,41 9.5,41 10,41.5 10,44.4 10.6,45 IC9.2
P3_3
  Bottom 0.203: JP3.4 42,18 23,26 17.84,31.16 U$1.14
P4_0  (via drill 0.3)
  Top 0.203: v12,28 9,30 9,31 13,33 14,34 13.5,38.7 JP1.2
  Bottom 0.203: U$1.20 13.64,26.36 arc-90 v12,28
P4_1
  Bottom 0.203: U$1.21 13.44,25.56 arc-90 11,28 11,31 arc-90 12,32 14,34 14,36 13,37 13,41 JP1.1
RX
  Bottom 0.203: U$1.12 18,40 16,45 12,45 12,47 10,48 7,50
SWDIO
  Bottom 0.203: JP3.5 42,19 26.3,29.3 24.04,31.96 U$1.13
VCC  (via drill 0.3)
  Top 0.203: JP2.1 73,38 67,38 L2.1-VDD 64,39.65 63.35,39.65 | L25.1-VDD 42.95,68.07 | 42.95,68.07 L53.1-VDD 40.8,66 43,66 | v30.89,14.03 30.89,14.53 | 30.89,14.53 L10.1-VDD 32.36,16 34,16 36.65,13.35 L9.1-VDD arc-90 38.3,13.95 L8.1-VDD arc-90 45.2,16.95 L7.1-VDD arc-90 47,17.15 47,18 arc-90 48.95,19.95 L6.1-VDD 52.2,22.2 arc-90 54,24 arc-36 L5.1-VDD L45.1-VDD | 30.89,14.53 30.89,18.11 30,19 27.36,19 L11.1-VDD 26.65,20.35 25,22 22.36,22 L12.1-VDD 22,21.64 22,22 22,23 | 63.35,39.65 62,41 62,44 63.65,45.65 | 63.65,45.65 64,45.65 L1.1-VDD 67,48.1 67,50 65.35,51.65 L30.1-VDD 62,54.2 62,55 | 62,55 64.55,57.55 L29.1-VDD | L28.1-VDD 60.35,56.65 62,55 | L28.1-VDD 60.3,60.7 60,61 | 43,66 49,66 49.7,66.7 L26.1-VDD 50.35,63.65 51,63 54.64,63 L27.1-VDD arc-6 59,67 arc-41 62,68 arc-86 65,65 arc-117 62,63 arc177 61,61 L28.1-VDD | 43,66 44,65 44,61 43.35,60.35 L54.1-VDD | L20.1-VDD arc90 19.85,61 21,61 arc90 23.8,63.8 L21.1-VDD arc90 24.85,64 27,64 29,66 29,67.85 L22.1-VDD 28.95,68.05 30,67 32,67 34,69 34,70.85 L23.1-VDD 38.7,71.05 L24.1-VDD 42.95,68.07 | L19.1-VDD 13.8,56.7 arc-90 L18.1-VDD 11.65,54.35 arc-90 14,52 14,51.55 | 14,51.55 14,50.9 arc-90 L17.1-VDD 11.65,48.35 arc-90 14,46 14,44.9 arc-90 L16.1-VDD | L38.1-VDD L51.1-VDD arc90 30.35,50.28 L35.1-VDD arc90 32.9,49 34,49 arc90 36.35,51.35 L34.1-VDD arc90 38.9,49 40,49 arc90 42.35,51.35 L33.1-VDD | L38.1-VDD 26.2,46.8 28,45 28,41.85 L39.1-VDD 30.2,41.8 31,41 31,36.85 L40.1-VDD 33.1,36.8 35.45,34.45 L52.1-VDD | L52.1-VDD 35.7,33.55 L41.1-VDD | L52.1-VDD 37,32.9 37,28 36.87,27.87 L42.1-VDD 39.6,27.69 L44.1-VDD
  Top 0.203: L44.1-VDD 42.7,22.6 L43.1-VDD | L44.1-VDD 44.59,24.59 arc90 47,27 47,27.64 arc90 L45.1-VDD | L45.1-VDD 47.35,29.35 arc90 50,32 50,32.64 arc90 L46.1-VDD 50.35,34.35 arc90 53,37 53,37.64 arc90 L47.1-VDD | L47.1-VDD 52.35,39.35 arc90 56,43 arc103 L48.1-VDD 56.35,44.35 arc90 59,47 | L49.1-VDD 43.94,42.72 L50.1-VDD | 14,51.55 L37.1-VDD arc-90 19.8,53 22.9,53 L36.1-VDD arc-90 25,50.9 25,47 arc90 24.95,46.95 L38.1-VDD | 59,47 arc90 57,49 56.9,49 arc-90 L31.1-VDD 53.34,48.9 arc-88 52.09,48.3 50.74,48.75 arc-39 49.57,49.66 L32.1-VDD | 59,47 arc90 60.35,45.65 63.65,45.65 | 63.35,39.65 62.95,39.65 arc90 L56.1-VDD 57.63,34.63 arc-90 58,35 63.2,35 arc-90 L3.1-VDD 64.55,33.26 arc-90 L55.1-VDD arc90 62.2,30.91 L4.1-VDD | 22,23 20.7,24.3 L13.1-VDD 16.65,26.17 L57.1-VDD arc15 L14.1-VDD | L58.1-VDD arc-90 22,28.82 22,23 | L49.1-VDD 47.72,46.72 | L47.1-VDD 46.64,44 46.64,45.43 L49.1-VDD | v12.5,43.5 12,42.9 L16.1-VDD | L15.1-VDD v11,38 12.7,38 13,40 11.78,41.85 | L16.1-VDD 11.78,41.85 | v13,42 11.78,41.85
  Bottom 0.203: 32,11 31.6,10.6 D1.C 31.45,13.47 v30.89,14.03 | IC9.5 12.85,43.85 v12.5,43.5 | v11,38 IC2.3 | IC2.1 11.78,41.85 v13,42
VCCD
  Bottom 0.203: U$1.33 4.79,21.02 C23.1

### Text on the board
tNames: charliex